# EAGLE design AlejandroRuiz_seguidor (4) (EAGLE 9.5.2)
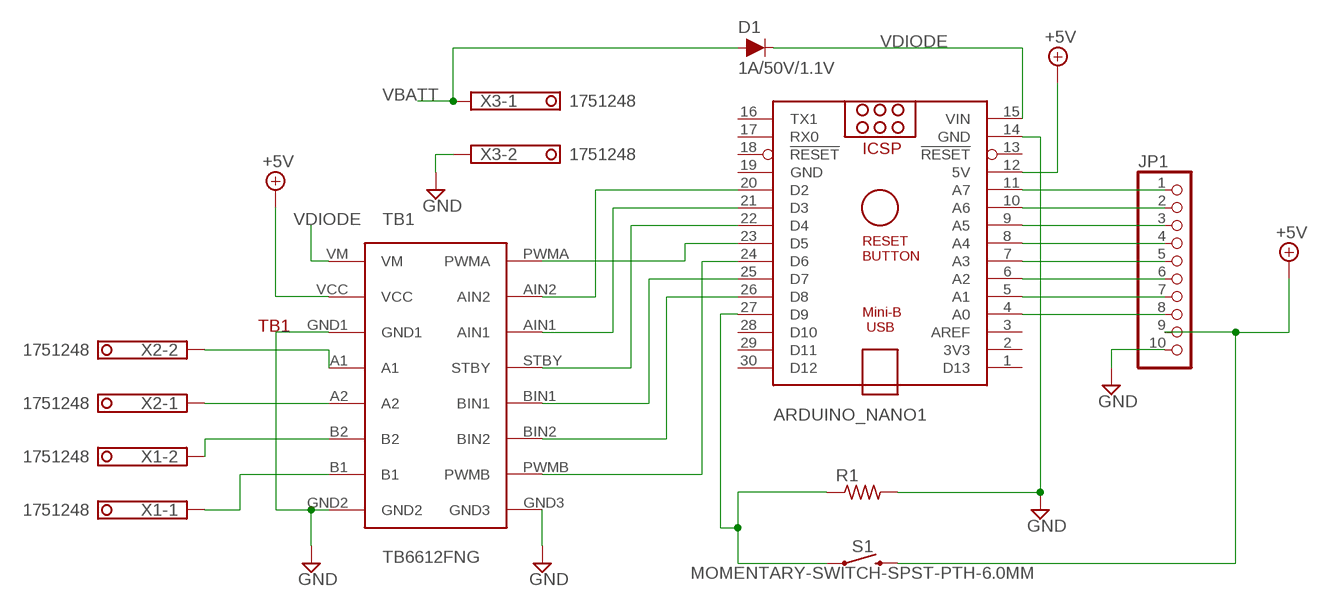
[diagram p0: schematic, sheet 1]

## Parts
ARDUINO_NANO1  ARDUINO_NANO  [ARDUINO_NANO]
D1  1A/50V/1.1V  DIODE-PTH  [DIODE-1N4001]
JP1  PINHD-1X10  [1X10]
R1  R-US_0204/5  [0204/5]
S1  MOMENTARY-SWITCH-SPST-PTH-6.0MM  [TACTILE_SWITCH_PTH_6.0MM]
TB1  TB6612FNG  [TB6612FNG]
X1  1751248  [1751248]
X2  1751248  [1751248]
X3  1751248  [1751248]

## Nets
+5V: ARDUINO_NANO1.12(5V) JP1.9 S1.3 TB1.VCC
GND: ARDUINO_NANO1.14(GND) JP1.10 R1.2 TB1.GND1 TB1.GND2 TB1.GND3 X3.2
N$1: ARDUINO_NANO1.24(D6) TB1.PWMB
N$2: ARDUINO_NANO1.23(D5) TB1.PWMA
N$3: ARDUINO_NANO1.20(D2) TB1.AIN2
N$4: ARDUINO_NANO1.21(D3) TB1.AIN1
N$5: ARDUINO_NANO1.22(D4) TB1.STBY
N$6: ARDUINO_NANO1.25(D7) TB1.BIN1
N$7: ARDUINO_NANO1.26(D8) TB1.BIN2
N$8: ARDUINO_NANO1.11(A7) JP1.1
N$9: ARDUINO_NANO1.10(A6) JP1.2
N$10: ARDUINO_NANO1.9(A5) JP1.3
N$11: ARDUINO_NANO1.8(A4) JP1.4
N$12: ARDUINO_NANO1.7(A3) JP1.5
N$13: ARDUINO_NANO1.6(A2) JP1.6
N$14: ARDUINO_NANO1.5(A1) JP1.7
N$15: ARDUINO_NANO1.4(A0) JP1.8
N$16: ARDUINO_NANO1.27(D9) R1.1 S1.1
N$17: TB1.A1 X2.2
N$19: TB1.B2 X1.2
N$20: TB1.B1 X1.1
N$21: TB1.A2 X2.1
VBATT: D1.A X3.1
VDIODE: ARDUINO_NANO1.15(VIN) D1.C TB1.VM
Unconnected: ARDUINO_NANO1.1(D13) ARDUINO_NANO1.2(3V3) ARDUINO_NANO1.3(AREF) ARDUINO_NANO1.13(!RESET) ARDUINO_NANO1.16(TX1) ARDUINO_NANO1.17(RX0) ARDUINO_NANO1.18(!RESET) ARDUINO_NANO1.28(D10) ARDUINO_NANO1.29(D11) ARDUINO_NANO1.30(D12)

## Power pins joined to a net without a drawn wire
GND: ARDUINO_NANO1.19(GND)

## Library data of the parts
ARDUINO_NANO1 = ArduinoNanoV30:ARDUINO_NANO: Arduino Nano V3.0 Overview: The Arduino Nano is a small, complete, and breadboard-friendly board based on the ATmega328 (Arduino Nano 3.x) or ATmega168 (Arduino Nano 2.x). It has more or less the same functionality of the Arduino Duemilanove, but in a different package. It lacks only a DC power jack, and works with a Mini-B USB cable instead of a standard one. The Nano was designed and is being produced by Gravitech. Specifications: Microcontroller Atmel ATmega168 or ATmega328 Operating Voltage (logic level) 5 V Input Voltage (recommended) 7-12 V Input Voltage (limits) 6-20 V Digital I/O Pins 14 (of which 6 provide PWM output) Analog Input Pins 8 DC Current per I/O Pin 40 mA Flash Memory 16 KB (ATmega168) or 32 KB (ATmega328) of which 2 KB used by bootloader SRAM 1 KB (ATmega168) or 2 KB (ATmega328) EEPROM 512 bytes (ATmega168) or 1 KB (ATmega328) Clock Speed 16 MHz Dimensions 0.73" x 1.70" Length 45 mm Width 18 mm Weigth 5 g Power: The Arduino Nano can be powered via the Mini-B USB connection, 6-20V unregulated external power supply (pin 30), or 5V regulated external power supply (pin 27). The power source is automatically selected to the highest voltage source. Memory: The ATmega168 has 16 KB of flash memory for storing code (of which 2 KB is used for the bootloader); the ATmega328 has 32 KB, (also with 2 KB used for the bootloader). The ATmega168 has 1 KB of SRAM and 512 bytes of EEPROM (which can be read and written with the EEPROM library); the ATmega328 has 2 KB of SRAM and 1 KB of EEPROM. Input and Output: Each of the 14 digital pins on the Nano can be used as an input or output, using pinMode(), digitalWrite(), and digitalRead() functions. They operate at 5 volts. Each pin can provide or receive a maximum of 40 mA and has an internal pull-up resistor (disconnected by default) of 20-50 kOhms. In addition, some pins have specialized functions. Visit Arduino - ArduinoBoardNano <https://www.arduino.cc/en/Main/ArduinoBoardNano>
D1 = SparkFun-DiscreteSemi:DIODE: Diode These are standard reverse protection diodes and small signal diodes. SparkFun Products: SparkFun SparkPunk Sound Kit <https://www.sparkfun.com/products/11177> SparkFun ESP8266 Thing <https://www.sparkfun.com/products/13231>; PROD_ID: DIO-09176
JP1 = pinhead:PINHD-1X10: PIN HEADER
R1 = rcl:R-US_: RESISTOR, American symbol; SPICEPREFIX: R
S1 = SparkFun-Switches:MOMENTARY-SWITCH-SPST: Momentary Switch (Pushbutton) - SPST Normally-open (NO) SPST momentary switches (buttons, pushbuttons). Variants PTH-12MM - 12mm square, through-hole Momentary Pushbutton Switch - 12mm Square <https://www.sparkfun.com/products/9190> (COM-09190) PTH-6.0MM, PTH-6.0MM-KIT - 6.0mm square, through-hole Mini Pushbutton Switch <https://www.sparkfun.com/products/97> (COM-00097) KIT package intended for soldering kit's - only one side of pads' copper is exposed. PTH-RIGHT-ANGLE-KIT - Right-angle, through-hole Right Angle Tactile Button <https://www.sparkfun.com/products/10791> - Used on SparkFun BigTime Watch Kit <https://www.sparkfun.com/products/11734> SMD-12MM - 12mm square, surface-mount Tactile Button - SMD (12mm) <https://www.sparkfun.com/products/12993> (COM-12993) Used on SparkFun PicoBoard <https://www.sparkfun.com/products/11888> SMD-4.5MM - 4.5mm Square Trackball Switch Used on SparkFun Blackberry Trackballer Breakout <https://www.sparkfun.com/products/13169> SMD-4.6MMX2.8MM - 4.60mm x 2.80mm, surface mount Used on SparkFun SAMD21 Mini Breakout <https://www.sparkfun.com/products/13664> SMD-5.2MM, SMD-5.2-REDUNDANT - 5.2mm square, surface-mount Mini Pushbutton Switch - SMD <https://www.sparkfun.com/products/8720> (COM-08720) Used on Arduino Pro Mini <https://www.sparkfun.com/products/11114> REDUNDANT package connects both switch circuits together SMD-6.0X3.5MM - 6.0 x 3.5mm, surface mount Momentary Reset Switch SMD <https://www.sparkfun.com/products/8229> (COM-08229) SMD-6.2MM-TALL - 6.2mm square, surface mount Tactile Button - SMD (6mm) <https://www.sparkfun.com/products/12992> Used on SparkFun Digital Sandbox <https://www.sparkfun.com/products/12651> SMD-RIGHT-ANGLE - Right-angle, surface mount Used on SparkFun Block for Intel® Edison - Arduino <https://www.sparkfun.com/products/13036>; PROD_ID: SWCH-08441; SF_SKU: COM-00097
TB1 = TB6612FNG:TB6612FNG
X1-X3 = con-phoenix-350:1751248: MKDS 1/ 2-3,5 Printklemme Nennstrom: 10 A Bemessungsspannung: 160 V Raster: 3,5 mm Polzahl: 2 Montageart: Löten Anschlussart: Schraubanschluss Anschlussrichtung vom Leiter zur Platine: 0° Source: http://eshop.phoenixcontact.com .. 1751248.pdf; OC_FARNELL: unknown; OC_NEWARK: unknown

## Board
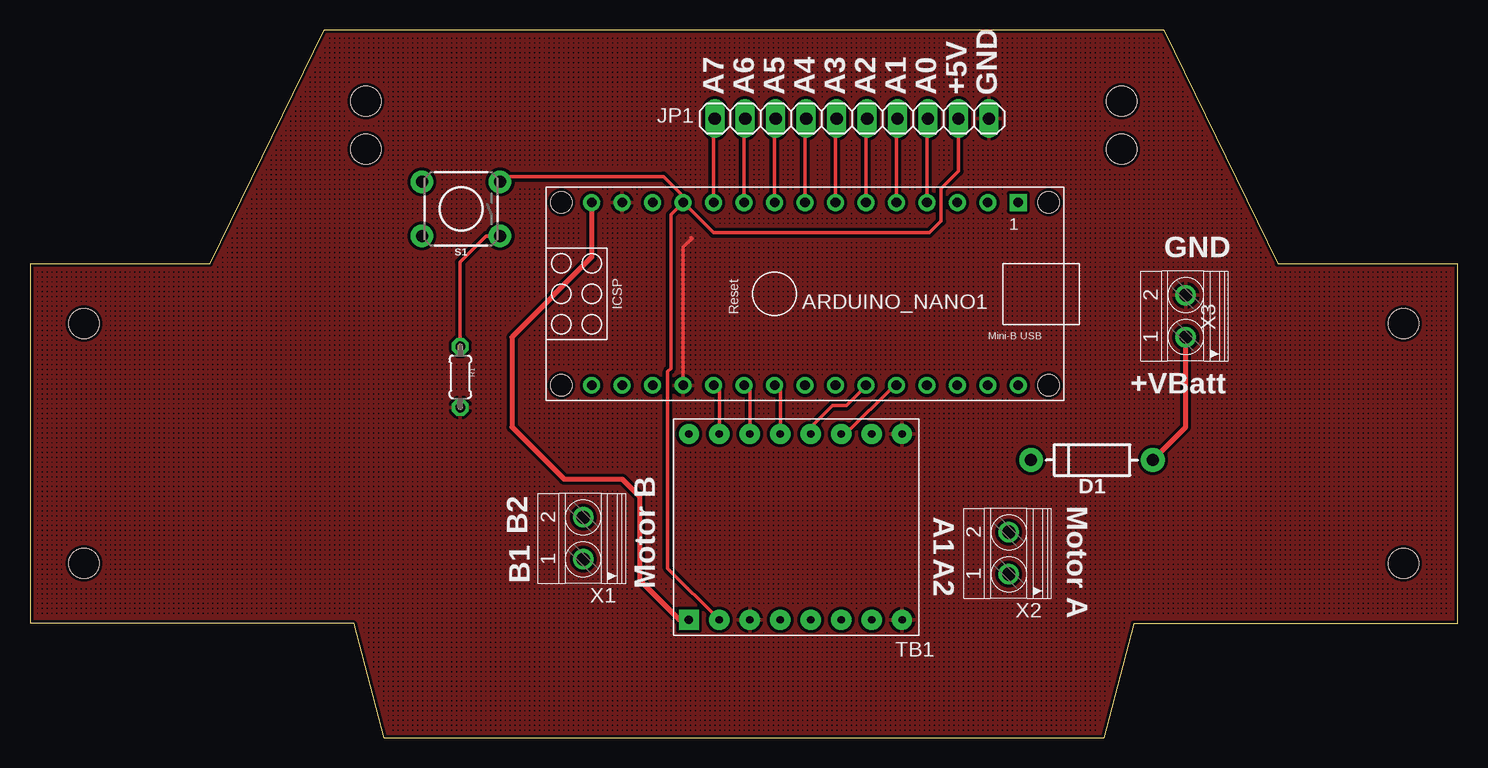
[diagram p1: board, top side]
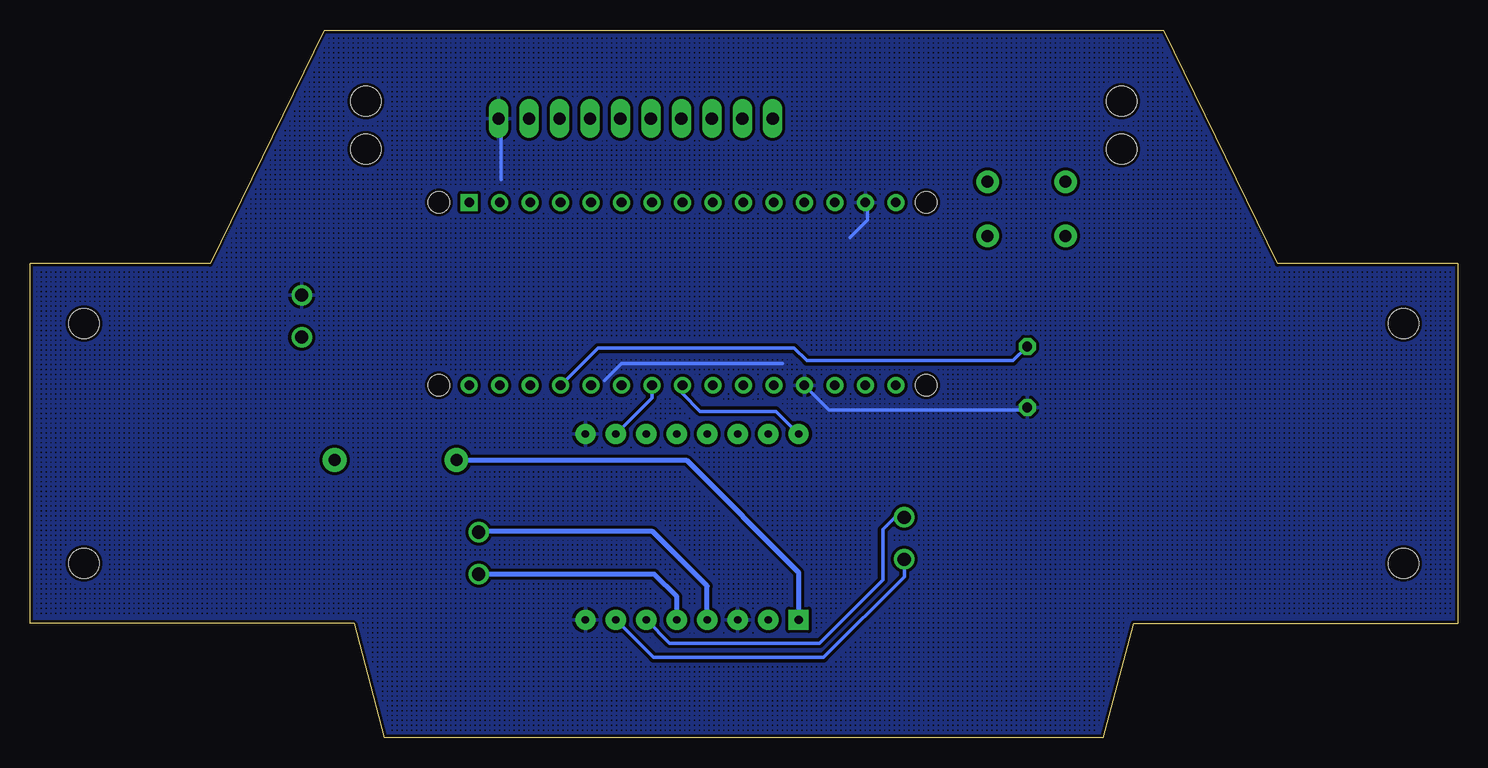
[diagram p2: board, bottom side, seen from below]

Size 119 x 59 mm. Coordinates in mm from the lower left corner, seen from the top.
Outline: 29.5,0 89.5,0 92,9.52 119,9.52 119,39.52 104,39.52 94.5,59 24.5,59 15,39.52 0,39.52 0,9.52 27,9.52 29.5,0
Copper layers (1*16): Top 0.035mm / dielectric 1.5mm / Bottom 0.035mm
Design rules "SparkFun": minimum track width 8mil, minimum drill 20mil, track to track 8mil, track to pad 8mil, pad to pad 8mil, via to via 8mil, smd to smd 8mil, copper to edge 10mil, drill to drill 8mil, minimum pad ring 12mil, minimum via ring 10mil, stop-mask expansion 4mil, vias tented up to drill 25mil, thermal gap 10mil
Holes 2.5 mm at 4.5,34.52 4.5,14.52 114.5,34.52 114.5,14.52 91,53.06 91,49.06 28,53.06 28,49.06

### Footprints (pad centres in the part's own frame; a part is rotated, then mirrored left to right if it is on the bottom)
ARDUINO_NANO = drill 0.8 square: 1 -20.32,-7.62 | drill 0.8: 2 -17.78,-7.62; 3 -15.24,-7.62; 4 -12.7,-7.62; 5 -10.16,-7.62; 6 -7.62,-7.62; 7 -5.08,-7.62; 8 -2.54,-7.62; 9 0,-7.62; 10 2.54,-7.62; 11 5.08,-7.62; 12 7.62,-7.62; 13 10.16,-7.62; 14 12.7,-7.62; 15 15.24,-7.62; 16 15.24,7.62; 17 12.7,7.62; 18 10.16,7.62; 19 7.62,7.62; 20 5.08,7.62; 21 2.54,7.62; 22 0,7.62; 23 -2.54,7.62; 24 -5.08,7.62; 25 -7.62,7.62; 26 -10.16,7.62; 27 -12.7,7.62; 28 -15.24,7.62; 29 -17.78,7.62; 30 -20.32,7.62 | hole 1.778: -22.86,-7.62; -22.86,7.62; 17.78,7.62; 17.78,-7.62
DIODE-1N4001 = drill 1 pad 1.981: A -5.08,0; C 5.08,0
1X10 = drill 1.016 long: 1 -11.43,0; 2 -8.89,0; 3 -6.35,0; 4 -3.81,0; 5 -1.27,0; 6 1.27,0; 7 3.81,0; 8 6.35,0; 9 8.89,0; 10 11.43,0
0204/5 = drill 0.813 octagon: 1 -2.54,0; 2 2.54,0
TACTILE_SWITCH_PTH_6.0MM = drill 1.016 pad 1.88: 1 -3.251,2.261; 2 3.251,2.261; 3 -3.251,-2.261; 4 3.251,-2.261
TB6612FNG = drill 0.6 pad 1.676: A1 -7.62,-1.27; A2 -7.62,-3.81; AIN1 7.874,1.27; AIN2 7.874,3.81; B1 -7.62,-8.89; B2 -7.62,-6.35; BIN1 7.874,-3.81; BIN2 7.874,-6.35; GND1 -7.62,1.27; GND2 -7.62,-11.43; GND3 7.874,-11.43; PWMA 7.874,6.35; PWMB 7.874,-8.89; STBY 7.874,-1.27; VCC -7.62,3.81 | drill 0.7 pad 1.676 square: VM -7.62,6.35
1751248 = drill 1.1 pad 1.7: 1 -1.75,-0.1; 2 1.75,-0.1

### Placement (x,y rotation side)
ARDUINO_NANO1  62.07,36.99 180 top
D1  88.53,23.14 180 top
JP1  68.51,51.61 0 top
R1  35.87,30.07 270 top
S1  35.93,44.08 180 top
TB1  61.27,17.43 90 top
X1  46.02,16.62 90 top
X2  81.5,15.37 90 top
X3  96.25,35.14 90 top

### Tracks (layer width: path | path; a pad name or v marks a point on that pad's centre or on a via)
+5V
  Top 0.305: TB1.VCC 53.16,14.11 53.16,30.5 53.44,30.78 53.44,43.6 ARDUINO_NANO1.12 54.6,44.46 | JP1.9 77.4,47.22 75.94,45.76 75.94,43.06 74.98,42.09 56.97,42.09 54.6,44.46 | S1.3 39.62,46.78 52.8,46.78 54.6,44.98 54.6,44.46
GND
  Top 0.305: ARDUINO_NANO1.19 54.45,40.9 55.17,41.62 55.12,41.68
  Bottom 0.305: 50.67,41.68 49.2,43.15 49.2,44.45 ARDUINO_NANO1.14 | 79.71,46.54 79.71,51.38 JP1.10 | 71.11,29.78 69.7,31.19 56.26,31.19 | R1.2 36.08,27.32 52.39,27.32 ARDUINO_NANO1.19
  pour Top (isolate 0.254, hatched): -3.23,61.01 123.46,61.01 123.46,-4.92 -3.23,-4.92
  pour Bottom (isolate 0.254, hatched): -3.79,62.8 126.36,62.8 126.36,-6.93 -3.79,-6.93
N$1
  Bottom 0.305: TB1.PWMB 67.15,28.32 ARDUINO_NANO1.24
N$2
  Bottom 0.305: TB1.PWMA 56.82,27.2 63.14,27.2 64.61,28.67 ARDUINO_NANO1.23
N$3
  Top 0.305: TB1.AIN2 57.46,28.9 ARDUINO_NANO1.20
N$4
  Top 0.305: TB1.AIN1 60,28.9 ARDUINO_NANO1.21
N$5
  Top 0.305: TB1.STBY 62.54,28.9 ARDUINO_NANO1.22
N$6
  Top 0.305: TB1.BIN1 65.08,25.86 66.89,27.67 68.06,27.67 69.69,29.3 ARDUINO_NANO1.25
N$7
  Top 0.305: TB1.BIN2 67.97,25.3 72.05,29.38 ARDUINO_NANO1.26
N$8
  Top 0.305: ARDUINO_NANO1.11 56.99,51.52 JP1.1
N$9
  Top 0.305: ARDUINO_NANO1.10 59.53,51.52 JP1.2
N$10
  Top 0.305: ARDUINO_NANO1.9 62.07,51.52 JP1.3
N$11
  Top 0.305: ARDUINO_NANO1.8 64.61,51.52 JP1.4
N$12
  Top 0.305: ARDUINO_NANO1.7 67.15,51.52 JP1.5
N$13
  Top 0.305: ARDUINO_NANO1.6 69.69,51.52 JP1.6
N$14
  Top 0.305: ARDUINO_NANO1.5 72.23,51.52 JP1.7
N$15
  Top 0.305: ARDUINO_NANO1.4 74.77,51.52 JP1.8
N$16
  Top 0.305: S1.1 38.04,41.82 35.85,39.63 35.85,32.63 R1.1
  Bottom 0.305: ARDUINO_NANO1.27 71.66,32.48 55.29,32.48 54.25,31.43 37.04,31.43 R1.1
N$17
  Bottom 0.406: TB1.A1 62.54,12.63 67.1,17.18 81.53,17.18 X2.2
N$19
  Bottom 0.305: X1.2 46.9,18.37 47.91,17.35 47.91,13.13 53.18,7.86 65.67,7.86 TB1.B2
N$20
  Bottom 0.305: TB1.B1 67.04,6.68 52.84,6.68 46.12,13.4 X1.1
N$21
  Bottom 0.406: TB1.A2 65.08,11.74 66.96,13.62 X2.1
VBATT
  Top 0.406: D1.A 96.35,25.88 X3.1
VDIODE
  Top 0.305: 54.16,9.81 TB1.VM
  Top 0.406: 54.16,9.81 50.85,13.12 50.85,20.07 49.37,21.55 44.52,21.55 40.17,25.89 40.17,33.39 46.83,40.05 ARDUINO_NANO1.15
  Bottom 0.406: D1.C 64.29,23.14 54.92,13.77 TB1.VM

### Text on the board
tNames: A7 | A6 | A5 | A4 | A3 | A2 | A1 | A0 | +5V | GND | GND | +VBatt | B2 | Motor A | A1 | B1 | A2 | Motor B